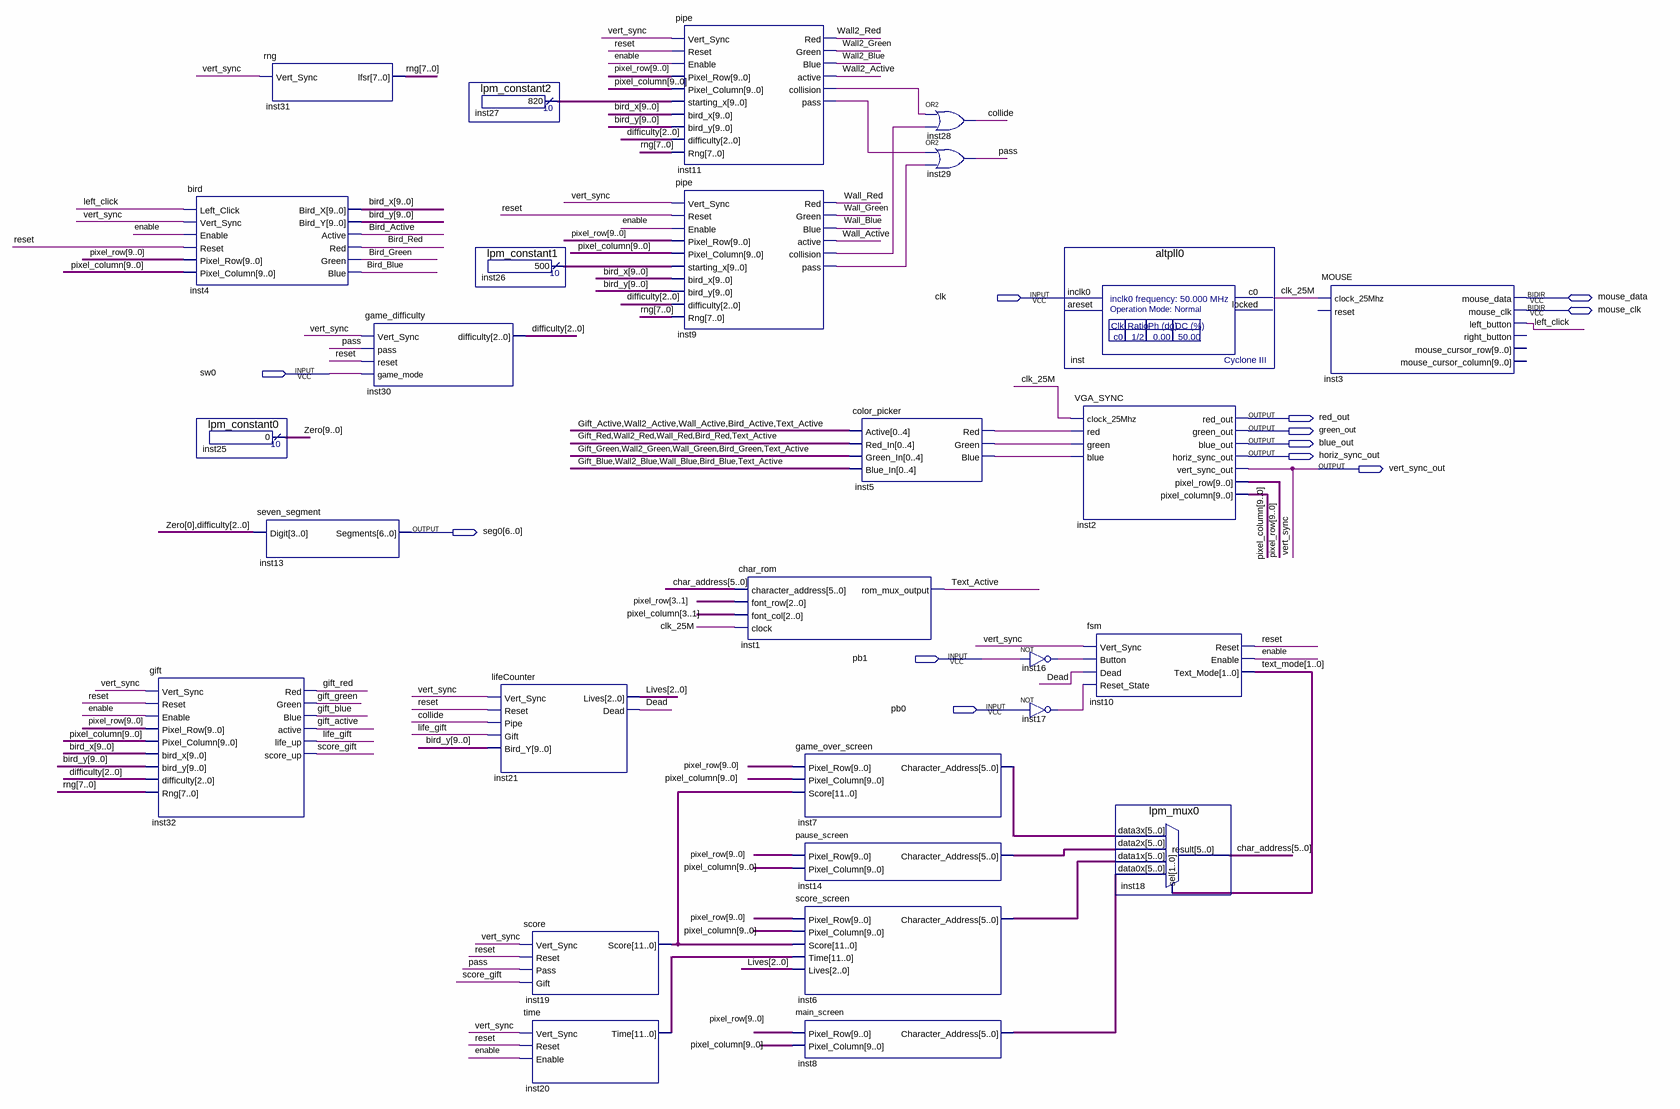
[diagram p0: schematic sheet]
// Quartus schematic game.bdf as structural Verilog: 28 symbols, 12 pins
module game (
  input  clk,
  input  sw0,
  input  pb1,
  input  pb0,
  inout  mouse_data,
  inout  mouse_clk,
  output red_out,
  output green_out,
  output blue_out,
  output horiz_sync_out,
  output vert_sync_out,
  output [6:0] seg0
);

  wire Bird_Active, Bird_Blue, Bird_Green, Bird_Red, clk_25M, collide, Dead, enable, gift_active, gift_blue,
       gift_green, gift_red, inst5_blue, inst5_green, inst5_red, inst9_collision, inst9_pass,
       inst11_collision, inst11_pass, inst16_out, inst17_out, left_click, life_gift, pass, reset, score_gift,
       Text_Active, Wall2_Active, Wall2_Blue, Wall2_Green, Wall2_Red, Wall_Active, Wall_Blue, Wall_Green,
       Wall_Red;
  wire [1:0] text_mode;
  wire [2:0] difficulty, Lives;
  wire [5:0] char_address, inst6_character_address, inst7_character_address, inst8_character_address,
       inst14_character_address;
  wire [7:0] rng;
  wire [9:0] bird_x, bird_y, inst26_result, inst27_result, pixel_column, pixel_row, Zero;
  wire [11:0] inst19_score, inst20_time;

  gift inst32 (
    .Vert_Sync(vert_sync_out), .Reset(reset), .Enable(enable), .Pixel_Row(pixel_row),
    .Pixel_Column(pixel_column), .bird_x(bird_x), .bird_y(bird_y), .difficulty(difficulty), .Rng(rng),
    .Red(gift_red), .Green(gift_green), .Blue(gift_blue), .active(gift_active), .life_up(life_gift),
    .score_up(score_gift));
  bird inst4 (
    .Left_Click(left_click), .Vert_Sync(vert_sync_out), .Enable(enable), .Reset(reset),
    .Pixel_Row(pixel_row), .Pixel_Column(pixel_column), .Bird_X(bird_x), .Bird_Y(bird_y),
    .Active(Bird_Active), .Red(Bird_Red), .Green(Bird_Green), .Blue(Bird_Blue));
  lpm_constant0 inst25 (.result(Zero));
  rng inst31 (.Vert_Sync(vert_sync_out), .lfsr(rng));
  seven_segment inst13 (.Digit({Zero[0], difficulty}), .Segments(seg0));
  game_difficulty inst30 (
    .Vert_Sync(vert_sync_out), .pass(pass), .reset(reset), .game_mode(sw0), .difficulty(difficulty));
  lpm_constant2 inst27 (.result(inst27_result));
  lpm_constant1 inst26 (.result(inst26_result));
  lifeCounter inst21 (
    .Vert_Sync(vert_sync_out), .Reset(reset), .Pipe(collide), .Gift(life_gift), .Bird_Y(bird_y),
    .Lives(Lives), .Dead(Dead));
  score inst19 (.Vert_Sync(vert_sync_out), .Reset(reset), .Pass(pass), .Gift(score_gift), .Score(inst19_score));
  \time  inst20 (.Vert_Sync(vert_sync_out), .Reset(reset), .Enable(enable), .Time(inst20_time));
  pipe inst11 (
    .Vert_Sync(vert_sync_out), .Reset(reset), .Enable(enable), .Pixel_Row(pixel_row),
    .Pixel_Column(pixel_column), .starting_x(inst27_result), .bird_x(bird_x), .bird_y(bird_y),
    .difficulty(difficulty), .Rng(rng), .Red(Wall2_Red), .Green(Wall2_Green), .Blue(Wall2_Blue),
    .active(Wall2_Active), .collision(inst11_collision), .pass(inst11_pass));
  pipe inst9 (
    .Vert_Sync(vert_sync_out), .Reset(reset), .Enable(enable), .Pixel_Row(pixel_row),
    .Pixel_Column(pixel_column), .starting_x(inst26_result), .bird_x(bird_x), .bird_y(bird_y),
    .difficulty(difficulty), .Rng(rng), .Red(Wall_Red), .Green(Wall_Green), .Blue(Wall_Blue),
    .active(Wall_Active), .collision(inst9_collision), .pass(inst9_pass));
  char_rom inst1 (
    .character_address(char_address), .font_row(pixel_row[3:1]), .font_col(pixel_column[3:1]),
    .clock(clk_25M), .rom_mux_output(Text_Active));
  game_over_screen inst7 (
    .Pixel_Row(pixel_row), .Pixel_Column(pixel_column), .Score(inst19_score),
    .Character_Address(inst7_character_address));
  pause_screen inst14 (
    .Pixel_Row(pixel_row), .Pixel_Column(pixel_column), .Character_Address(inst14_character_address));
  score_screen inst6 (
    .Pixel_Row(pixel_row), .Pixel_Column(pixel_column), .Score(inst19_score), .Time(inst20_time),
    .Lives(Lives), .Character_Address(inst6_character_address));
  main_screen inst8 (.Pixel_Row(pixel_row), .Pixel_Column(pixel_column), .Character_Address(inst8_character_address));
  color_picker inst5 (
    .Active({gift_active, Wall2_Active, Wall_Active, Bird_Active, Text_Active}),
    .Red_In({gift_red, Wall2_Red, Wall_Red, Bird_Red, Text_Active}),
    .Green_In({gift_green, Wall2_Green, Wall_Green, Bird_Green, Text_Active}),
    .Blue_In({gift_blue, Wall2_Blue, Wall_Blue, Bird_Blue, Text_Active}), .Red(inst5_red),
    .Green(inst5_green), .Blue(inst5_blue));
  or inst28 (collide, inst11_collision, inst9_collision);
  or inst29 (pass, inst11_pass, inst9_pass);
  not inst16 (inst16_out, pb1);
  not inst17 (inst17_out, pb0);
  altpll0 inst (.inclk0(clk), .c0(clk_25M));  // open: areset, locked
  VGA_SYNC inst2 (
    .clock_25Mhz(clk_25M), .red(inst5_red), .green(inst5_green), .blue(inst5_blue), .red_out(red_out),
    .green_out(green_out), .blue_out(blue_out), .horiz_sync_out(horiz_sync_out),
    .vert_sync_out(vert_sync_out), .pixel_row(pixel_row), .pixel_column(pixel_column));
  fsm inst10 (
    .Vert_Sync(vert_sync_out), .Button(inst16_out), .Dead(Dead), .Reset_State(inst17_out), .Reset(reset),
    .Enable(enable), .Text_Mode(text_mode));
  lpm_mux0 inst18 (
    .data3x(inst7_character_address), .data2x(inst14_character_address), .data1x(inst6_character_address),
    .data0x(inst8_character_address), .sel(text_mode), .result(char_address));
  MOUSE inst3 (
    .clock_25Mhz(clk_25M), .left_button(left_click), .mouse_data(mouse_data), .mouse_clk(mouse_clk));  // open: reset, right_button, mouse_cursor_row, mouse_cursor_column

  // Other names for the same wires on the sheet: vert_sync = vert_sync_out
endmodule
